# EAGLE schematic base (EAGLE 7.2.0)
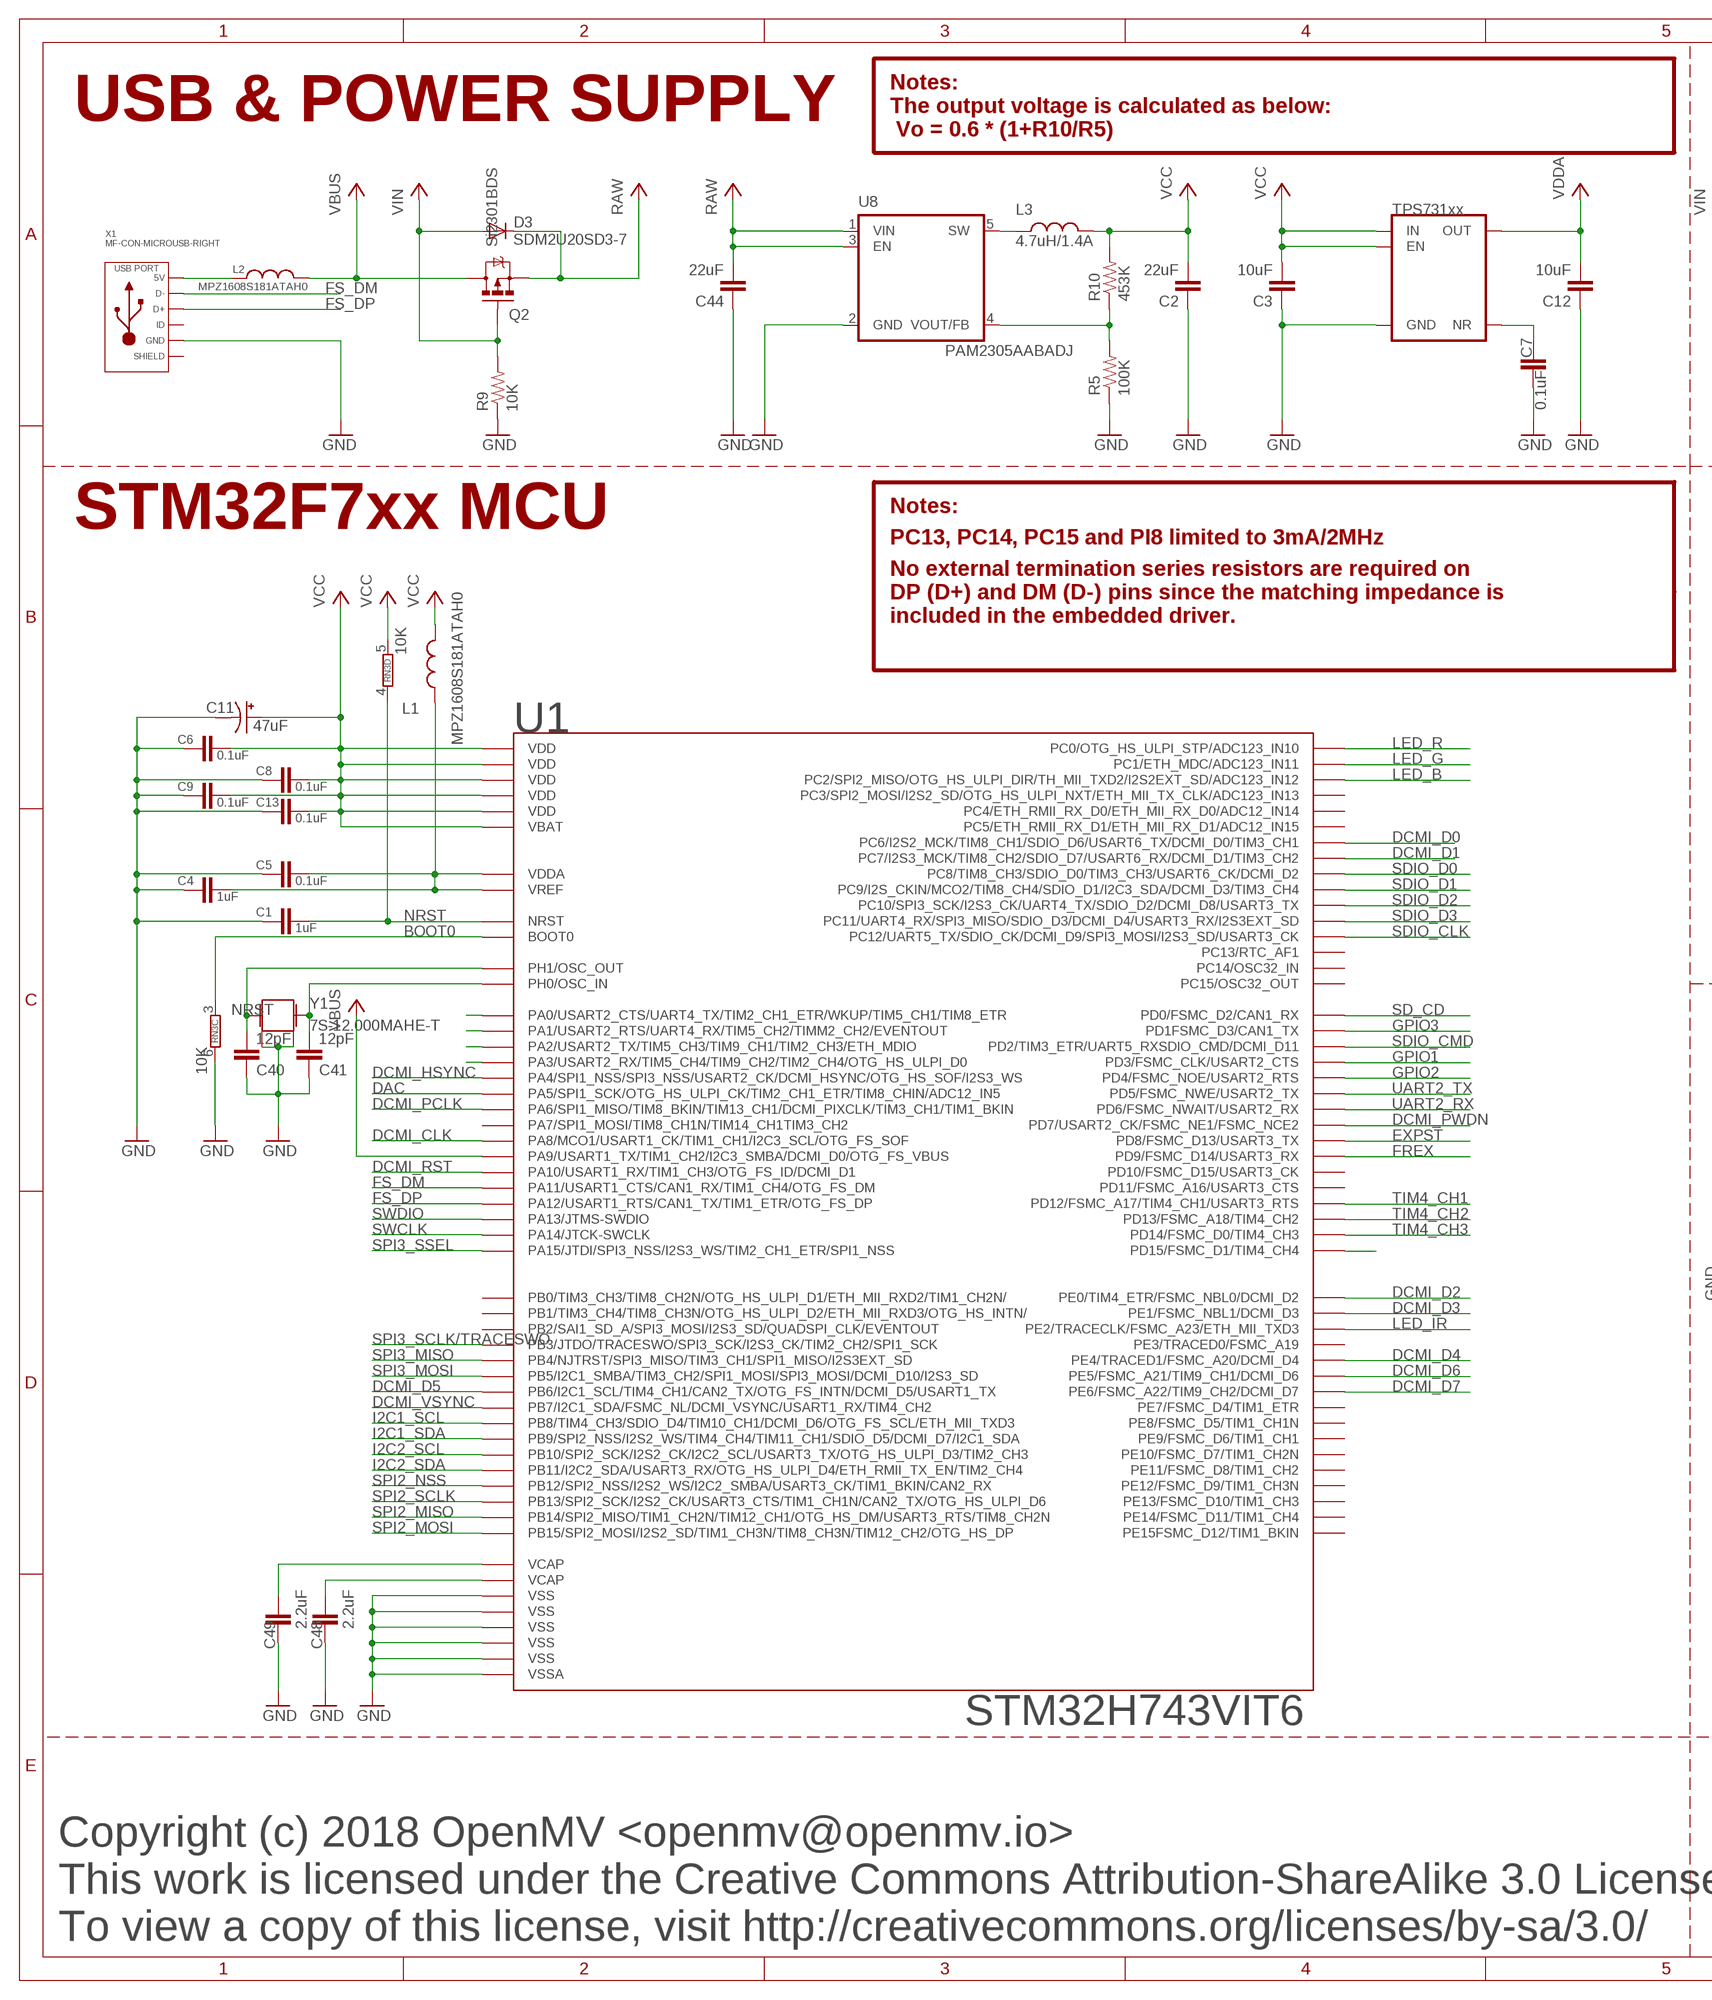
[diagram p0: schematic, sheet 1, part 1 of 2]
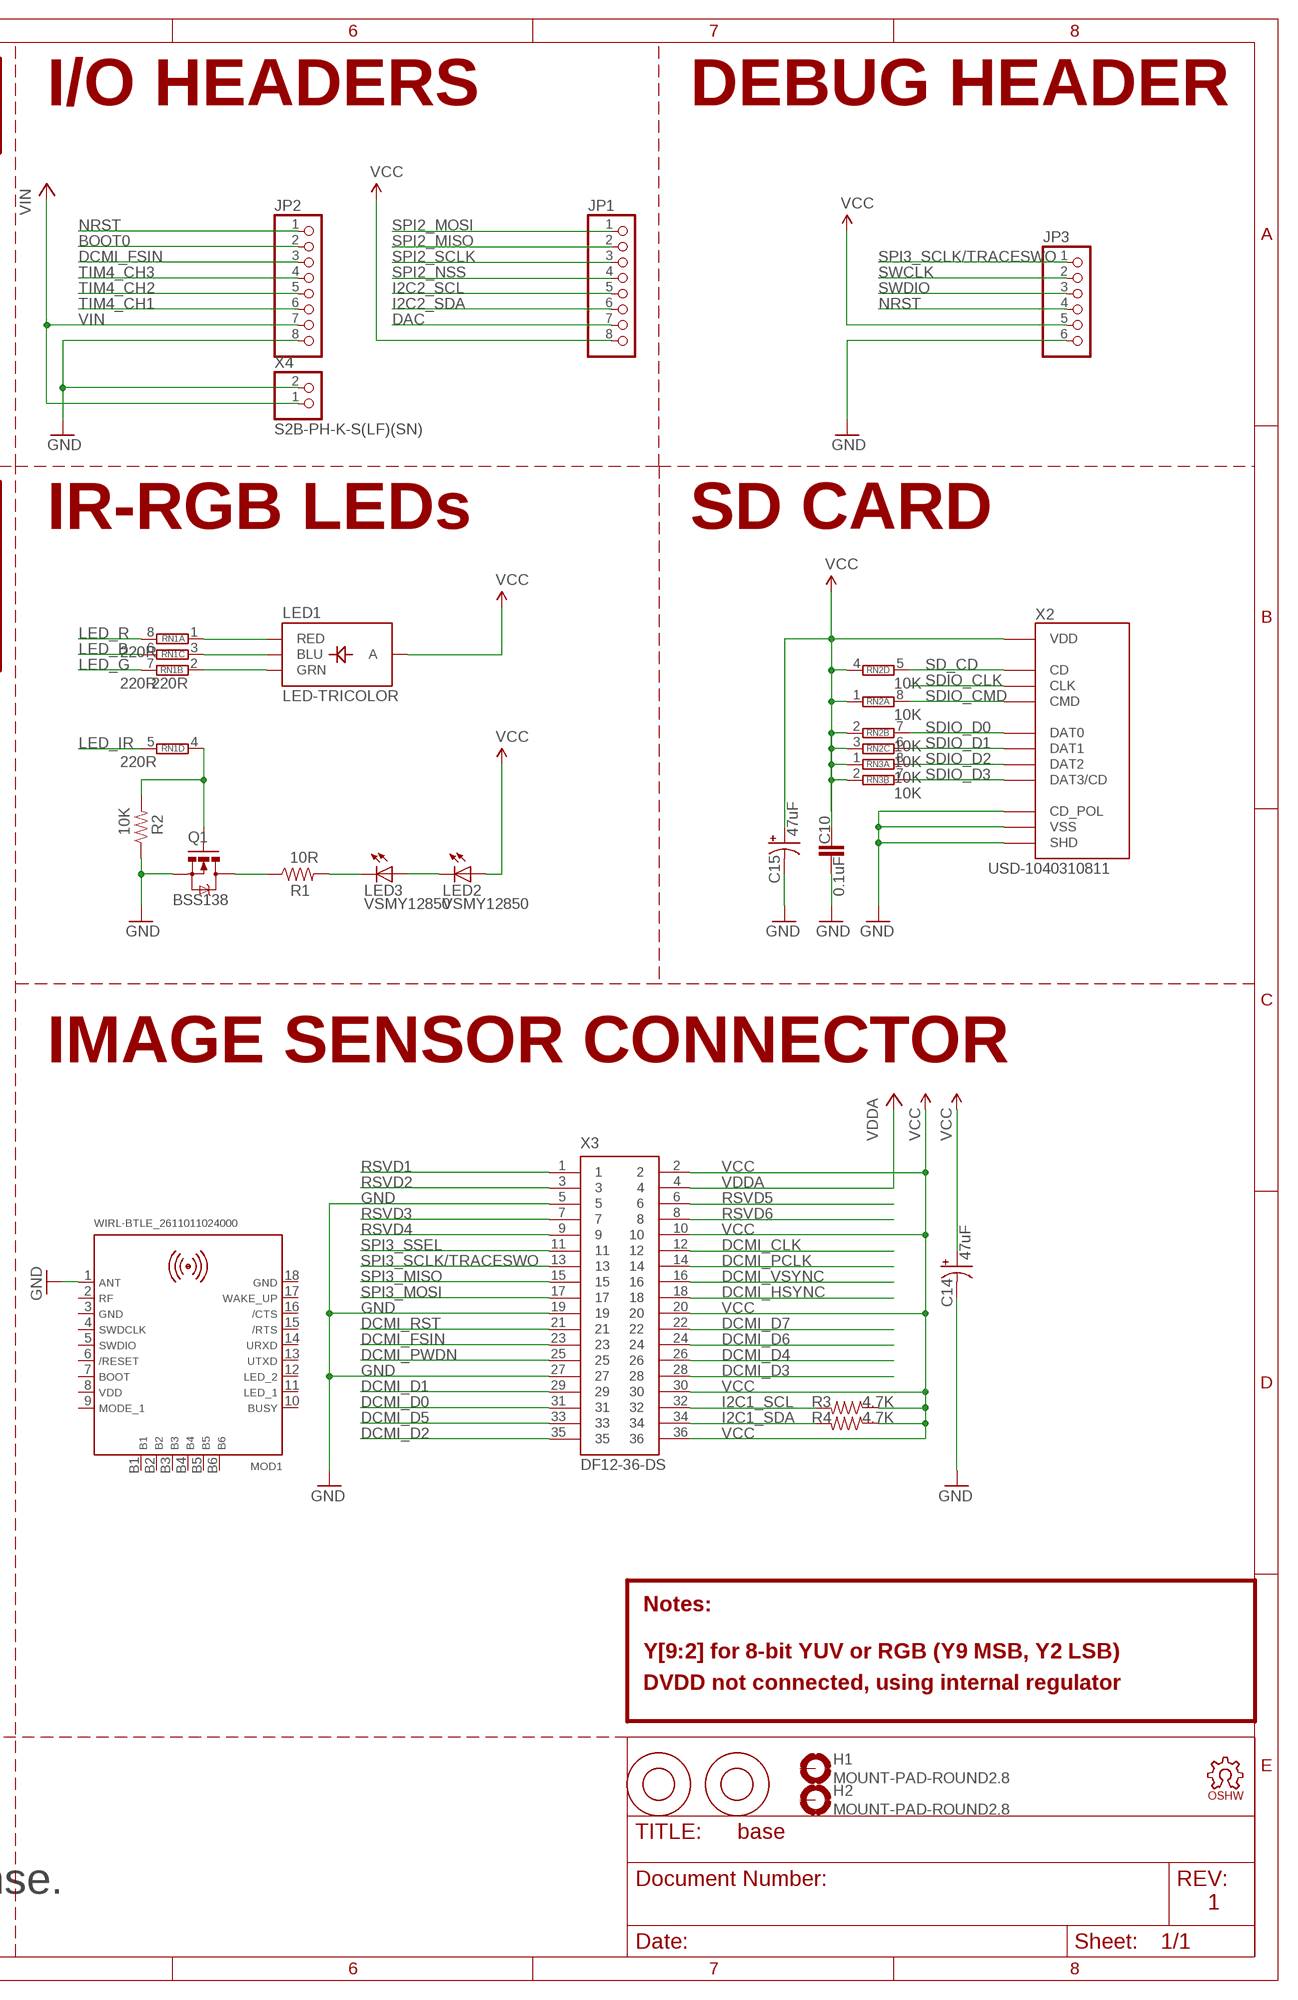
[diagram p1: schematic, sheet 1, part 2 of 2]

## Parts
C1  1uF  CAP0603-CAP  [0603-CAP]
C2  22uF  CAP0805  [0805]
C3  10uF  CAP0805  [0805]
C4  1uF  CAP0603-CAP  [0603-CAP]
C5  0.1uF  CAP0603-CAP  [0603-CAP]
C6  0.1uF  CAP0603-CAP  [0603-CAP]
C7  0.1uF  CAP0603-CAP  [0603-CAP]
C8  0.1uF  CAP0603-CAP  [0603-CAP]
C9  0.1uF  CAP0603-CAP  [0603-CAP]
C10  0.1uF  CAP0603-CAP  [0603-CAP]
C11  47uF  CAP_POL1206  [EIA3216]
C12  10uF  CAP0805  [0805]
C13  0.1uF  CAP0603-CAP  [0603-CAP]
C14  47uF  CAP_POL1206  [EIA3216]
C15  47uF  CAP_POL1206  [EIA3216]
C40  12pF  CAP0603-CAP  [0603-CAP]
C41  12pF  CAP0603-CAP  [0603-CAP]
C44  22uF  CAP0805  [0805]
C48  2.2uF  CAP0603-CAP  [0603-CAP]
C49  2.2uF  CAP0603-CAP  [0603-CAP]
D3  SDM2U20SD3-7  DIODESOD  [SOD-323]
H1  MOUNT-PAD-ROUND2.8  [2,8-PAD]
H2  MOUNT-PAD-ROUND2.8  [2,8-PAD]
JP1  PINHD-1X8  [1X08]
JP2  PINHD-1X8  [1X08]
JP3  PINHD-1X6  [1X06]
L1  MPZ1608S181ATAH0  INDUCTOR0603  [0603]
L2  MPZ1608S181ATAH0  INDUCTOR0603  [0603]
L3  4.7uH/1.4A  INDUCTOR1007  [1007]
LED1  LED-TRICOLOR  [LED-TRICOLOR-SMD-MF]
LED2  VSMY12850  LED1206  [LED-1206]
LED3  VSMY12850  LED1206  [LED-1206]
LOGO1  OSHW_LOGO_FILLX0100-NT  [OSHW_FILLX100_NOTEXT]
M1  9774030243R  9774030151R  [9774030151R]
M2  9774030243R  9774030151R  [9774030151R]
MOD1  WIRL-BTLE_2611011024000  [WE-FP-4+]
Q1  BSS138  MOSFET-NCHANNELSMD  [SOT23-3]
Q2  Si2301BDS  MOSFET-PCHANNELSMD  [SOT23-3]
R1  10R  RESISTOR0603-RES  [0603-RES]
R2  10K  RESISTOR0603-RES  [0603-RES]
R3  4.7K  RESISTOR0603-RES  [0603-RES]
R4  4.7K  RESISTOR0603-RES  [0603-RES]
R5  100K  RESISTOR0603-RES  [0603-RES]
R9  10K  RESISTOR0603-RES  [0603-RES]
R10  453K  RESISTOR0603-RES  [0603-RES]
RN1  220R  4R-NEXBV8V  [EXBV8V]
RN2  10K  4R-NEXBV8V  [EXBV8V]
RN3  10K  4R-NEXBV8V  [EXBV8V]
U1  STM32H743VIT6  STM32F746LQFP100  [LQFP100]
U5  TPS731XX  [SOT23-5]
U8  PAM2305AABADJ  PAM2305AAB330  [TSOT25]
X1  MF-CON-MICROUSB-RIGHT  USB_MICRO_RIGHT  [MICROUSB-RIGHT]
X2  USD-1040310811  [1040310811]
X3  DF12-36-DS  [DF12-36-DS]
X4  S2B-PH-K-S(LF)(SN)  JST_2PIN-THM-RA  [JST-PH-2-THM-RA]
Y1  7S-12.000MAHE-T  CRYSTAL2.5X2.0  [CRYSTAL-2.5X2.0]

## Nets
BOOT0: JP2.2 RN3.3 U1.94(BOOT0)
DAC: JP1.7 U1.29(PA5/SPI1_SCK/OTG_HS_ULPI_CK/TIM2_CH1_ETR/TIM8_CHIN/ADC12_IN5)
DCMI_CLK: U1.67(PA8/MCO1/USART1_CK/TIM1_CH1/I2C3_SCL/OTG_FS_SOF) X3.12
DCMI_D0: U1.63(PC6/I2S2_MCK/TIM8_CH1/SDIO_D6/USART6_TX/DCMI_D0/TIM3_CH1) X3.31
DCMI_D1: U1.64(PC7/I2S3_MCK/TIM8_CH2/SDIO_D7/USART6_RX/DCMI_D1/TIM3_CH2) X3.29
DCMI_D2: U1.97(PE0/TIM4_ETR/FSMC_NBL0/DCMI_D2) X3.35
DCMI_D3: U1.98(PE1/FSMC_NBL1/DCMI_D3) X3.28
DCMI_D4: U1.3(PE4/TRACED1/FSMC_A20/DCMI_D4) X3.26
DCMI_D5: U1.92(PB6/I2C1_SCL/TIM4_CH1/CAN2_TX/OTG_FS_INTN/DCMI_D5/USART1_TX) X3.33
DCMI_D6: U1.4(PE5/FSMC_A21/TIM9_CH1/DCMI_D6) X3.24
DCMI_D7: U1.5(PE6/FSMC_A22/TIM9_CH2/DCMI_D7) X3.22
DCMI_FSIN: JP2.3 X3.23
DCMI_HSYNC: U1.28(PA4/SPI1_NSS/SPI3_NSS/USART2_CK/DCMI_HSYNC/OTG_HS_SOF/I2S3_WS) X3.18
DCMI_PCLK: U1.30(PA6/SPI1_MISO/TIM8_BKIN/TIM13_CH1/DCMI_PIXCLK/TIM3_CH1/TIM1_BKIN) X3.14
DCMI_PWDN: U1.88(PD7/USART2_CK/FSMC_NE1/FSMC_NCE2) X3.25
DCMI_RST: U1.69(PA10/USART1_RX/TIM1_CH3/OTG_FS_ID/DCMI_D1) X3.21
DCMI_VSYNC: U1.93(PB7/I2C1_SDA/FSMC_NL/DCMI_VSYNC/USART1_RX/TIM4_CH2) X3.16
EXPST: U1.55(PD8/FSMC_D13/USART3_TX)
FREX: U1.56(PD9/FSMC_D14/USART3_RX)
FS_DM: U1.70(PA11/USART1_CTS/CAN1_RX/TIM1_CH4/OTG_FS_DM) X1.2(D-)
FS_DP: U1.71(PA12/USART1_RTS/CAN1_TX/TIM1_ETR/OTG_FS_DP) X1.3(D+)
GND: C1.2 C2.1 C3.1 C4.2 C5.2 C6.2 C7.2 C8.2 C9.2 C10.2 C11.C(-) C12.1 C13.2 C14.C(-) C15.C(-) C40.1 C41.1 C44.1 C48.2 C49.2 JP2.8 JP3.6 MOD1.1 Q1.2(S) R2.1 R5.1 R9.1 RN3.6 U1.10(VSS) U1.19(VSSA) U1.26(VSS) U1.49(VSS) U1.74(VSS) U1.99(VSS) U5.2(GND) U8.2(GND) X1.5(GND) X2.CD$2(CD_POL) X2.G$1(SHD) X2.G$2(SHD) X2.G$3(SHD) X2.G$4(SHD) X2.P$6(VSS) X3.5 X3.19 X3.27 X4.2 Y1.2 Y1.4
GPIO1: U1.84(PD3/FSMC_CLK/USART2_CTS)
GPIO2: U1.85(PD4/FSMC_NOE/USART2_RTS)
GPIO3: U1.82(PD1FSMC_D3/CAN1_TX)
I2C1_SCL: R3.2 U1.95(PB8/TIM4_CH3/SDIO_D4/TIM10_CH1/DCMI_D6/OTG_FS_SCL/ETH_MII_TXD3) X3.32
I2C1_SDA: R4.2 U1.96(PB9/SPI2_NSS/I2S2_WS/TIM4_CH4/TIM11_CH1/SDIO_D5/DCMI_D7/I2C1_SDA) X3.34
I2C2_SCL: JP1.5 U1.46(PB10/SPI2_SCK/I2S2_CK/I2C2_SCL/USART3_TX/OTG_HS_ULPI_D3/TIM2_CH3)
I2C2_SDA: JP1.6 U1.47(PB11/I2C2_SDA/USART3_RX/OTG_HS_ULPI_D4/ETH_RMII_TX_EN/TIM2_CH4)
LED_B: RN1.6 U1.17(PC2/SPI2_MISO/OTG_HS_ULPI_DIR/TH_MII_TXD2/I2S2EXT_SD/ADC123_IN12)
LED_G: RN1.7 U1.16(PC1/ETH_MDC/ADC123_IN11)
LED_IR: RN1.5 U1.1(PE2/TRACECLK/FSMC_A23/ETH_MII_TXD3)
LED_R: RN1.8 U1.15(PC0/OTG_HS_ULPI_STP/ADC123_IN10)
N$2: C40.2 U1.13(PH1/OSC_OUT) Y1.3
N$4: C41.2 U1.12(PH0/OSC_IN) Y1.1
N$5: Q1.1(G) R2.2 RN1.4
N$6: LED1.B(BLU) RN1.3
N$7: L2.1 X1.1(5V)
N$8: LED1.R(RED) RN1.1
N$9: LED1.G(GRN) RN1.2
N$10: LED3.C R1.2
N$11: C7.1 U5.4(NR)
N$12: C4.1 C5.1 L1.1 U1.20(VREF) U1.21(VDDA)
N$13: R5.2 R10.1 U8.4(VOUT/FB)
N$14: Q1.3(D) R1.1
N$17: LED2.C LED3.A
N$30: U1.62(PD15/FSMC_D1/TIM4_CH4)
N$31: U1.22(PA0/USART2_CTS/UART4_TX/TIM2_CH1_ETR/WKUP/TIM5_CH1/TIM8_ETR)
N$32: U1.23(PA1/USART2_RTS/UART4_RX/TIM5_CH2/TIMM2_CH2/EVENTOUT)
N$33: U1.24(PA2/USART2_TX/TIM5_CH3/TIM9_CH1/TIM2_CH3/ETH_MDIO)
N$34: U1.25(PA3/USART2_RX/TIM5_CH4/TIM9_CH2/TIM2_CH4/OTG_HS_ULPI_D0)
NRST: C1.1 JP2.1 JP3.4 RN3.4 U1.14(NRST)
RAW: C44.2 D3.1(C) Q2.2(S) U8.1(VIN) U8.3(EN)
RSVD1: X3.1
RSVD2: X3.3
RSVD3: X3.7
RSVD4: X3.9
RSVD5: X3.6
RSVD6: X3.8
SD_CD: RN2.5 U1.81(PD0/FSMC_D2/CAN1_RX) X2.CD$1(CD)
SDIO_CLK: U1.80(PC12/UART5_TX/SDIO_CK/DCMI_D9/SPI3_MOSI/I2S3_SD/USART3_CK) X2.P$5(CLK)
SDIO_CMD: RN2.8 U1.83(PD2/TIM3_ETR/UART5_RXSDIO_CMD/DCMI_D11) X2.P$3(CMD)
SDIO_D0: RN2.7 U1.65(PC8/TIM8_CH3/SDIO_D0/TIM3_CH3/USART6_CK/DCMI_D2) X2.P$7(DAT0)
SDIO_D1: RN2.6 U1.66(PC9/I2S_CKIN/MCO2/TIM8_CH4/SDIO_D1/I2C3_SDA/DCMI_D3/TIM3_CH4) X2.P$8(DAT1)
SDIO_D2: RN3.8 U1.78(PC10/SPI3_SCK/I2S3_CK/UART4_TX/SDIO_D2/DCMI_D8/USART3_TX) X2.P$1(DAT2)
SDIO_D3: RN3.7 U1.79(PC11/UART4_RX/SPI3_MISO/SDIO_D3/DCMI_D4/USART3_RX/I2S3EXT_SD) X2.P$2(DAT3/CD)
SPI2_MISO: JP1.2 U1.53(PB14/SPI2_MISO/TIM1_CH2N/TIM12_CH1/OTG_HS_DM/USART3_RTS/TIM8_CH2N)
SPI2_MOSI: JP1.1 U1.54(PB15/SPI2_MOSI/I2S2_SD/TIM1_CH3N/TIM8_CH3N/TIM12_CH2/OTG_HS_DP)
SPI2_NSS: JP1.4 U1.51(PB12/SPI2_NSS/I2S2_WS/I2C2_SMBA/USART3_CK/TIM1_BKIN/CAN2_RX)
SPI2_SCLK: JP1.3 U1.52(PB13/SPI2_SCK/I2S2_CK/USART3_CTS/TIM1_CH1N/CAN2_TX/OTG_HS_ULPI_D6)
SPI3_MISO: U1.90(PB4/NJTRST/SPI3_MISO/TIM3_CH1/SPI1_MISO/I2S3EXT_SD) X3.15
SPI3_MOSI: U1.91(PB5/I2C1_SMBA/TIM3_CH2/SPI1_MOSI/SPI3_MOSI/DCMI_D10/I2S3_SD) X3.17
SPI3_SCLK/TRACESWO: JP3.1 U1.89(PB3/JTDO/TRACESWO/SPI3_SCK/I2S3_CK/TIM2_CH2/SPI1_SCK) X3.13
SPI3_SSEL: U1.77(PA15/JTDI/SPI3_NSS/I2S3_WS/TIM2_CH1_ETR/SPI1_NSS) X3.11
SW: L3.1 U8.5(SW)
SWCLK: JP3.2 U1.76(PA14/JTCK-SWCLK)
SWDIO: JP3.3 U1.72(PA13/JTMS-SWDIO)
TIM4_CH1: JP2.6 U1.59(PD12/FSMC_A17/TIM4_CH1/USART3_RTS)
TIM4_CH2: JP2.5 U1.60(PD13/FSMC_A18/TIM4_CH2)
TIM4_CH3: JP2.4 U1.61(PD14/FSMC_D0/TIM4_CH3)
UART2_RX: U1.87(PD6/FSMC_NWAIT/USART2_RX)
UART2_TX: U1.86(PD5/FSMC_NWE/USART2_TX)
VBUS: L2.2 Q2.3(D) U1.68(PA9/USART1_TX/TIM1_CH2/I2C3_SMBA/DCMI_D0/OTG_FS_VBUS)
VCAP1: C49.1 U1.48(VCAP)
VCAP2: C48.1 U1.73(VCAP)
VCC: C2.2 C3.2 C6.1 C8.1 C9.1 C10.1 C11.A(+) C13.1 C14.A(+) C15.A(+) JP1.8 JP3.5 L1.2 L3.2 LED1.A LED2.A R3.1 R4.1 R10.2 RN2.1 RN2.2 RN2.3 RN2.4 RN3.1 RN3.2 RN3.5 U1.6(VBAT) U1.11(VDD) U1.27(VDD) U1.50(VDD) U1.75(VDD) U1.100(VDD) U5.1(IN) U5.3(EN) X2.P$4(VDD) X3.2 X3.10 X3.20 X3.30 X3.36
VDDA: C12.2 U5.5(OUT) X3.4
VIN: D3.2(A) JP2.7 Q2.1(G) R9.2 X4.1
Unconnected: H1.B2,8(MOUNT) H2.B2,8(MOUNT) MOD1.2 MOD1.3 MOD1.4 MOD1.5 MOD1.6 MOD1.7 MOD1.8 MOD1.9 MOD1.10 MOD1.11 MOD1.12 MOD1.13 MOD1.14 MOD1.15 MOD1.16 MOD1.17 MOD1.18 MOD1.B1 MOD1.B2 MOD1.B3 MOD1.B4 MOD1.B5 MOD1.B6 U1.2(PE3/TRACED0/FSMC_A19) U1.7(PC13/RTC_AF1) U1.8(PC14/OSC32_IN) U1.9(PC15/OSC32_OUT) U1.18(PC3/SPI2_MOSI/I2S2_SD/OTG_HS_ULPI_NXT/ETH_MII_TX_CLK/ADC123_IN13) U1.31(PA7/SPI1_MOSI/TIM8_CH1N/TIM14_CH1TIM3_CH2) U1.32(PC4/ETH_RMII_RX_D0/ETH_MII_RX_D0/ADC12_IN14) U1.33(PC5/ETH_RMII_RX_D1/ETH_MII_RX_D1/ADC12_IN15) U1.34(PB0/TIM3_CH3/TIM8_CH2N/OTG_HS_ULPI_D1/ETH_MII_RXD2/TIM1_CH2N/) U1.35(PB1/TIM3_CH4/TIM8_CH3N/OTG_HS_ULPI_D2/ETH_MII_RXD3/OTG_HS_INTN/) U1.36(PB2/SAI1_SD_A/SPI3_MOSI/I2S3_SD/QUADSPI_CLK/EVENTOUT) U1.37(PE7/FSMC_D4/TIM1_ETR) U1.38(PE8/FSMC_D5/TIM1_CH1N) U1.39(PE9/FSMC_D6/TIM1_CH1) U1.40(PE10/FSMC_D7/TIM1_CH2N) U1.41(PE11/FSMC_D8/TIM1_CH2) U1.42(PE12/FSMC_D9/TIM1_CH3N) U1.43(PE13/FSMC_D10/TIM1_CH3) U1.44(PE14/FSMC_D11/TIM1_CH4) U1.45(PE15FSMC_D12/TIM1_BKIN) U1.57(PD10/FSMC_D15/USART3_CK) U1.58(PD11/FSMC_A16/USART3_CTS) X1.4(ID) X1.S1(SLD) X1.S2(SLD) X1.S3(SLD) X1.S4(SLD) X1.S5(SLD) X1.S6(SLD)

## Notes on the sheet
- Notes:
- USB & POWER SUPPLY | I/O HEADERS | DEBUG HEADER
- The output voltage is calculated as below:
   Vo = 0.6 * (1+R10/R5)
- Notes:
- STM32F7xx MCU | IR-RGB LEDs | SD CARD
- PC13, PC14, PC15 and PI8 limited to 3mA/2MHz
- No external termination series resistors are required on
  DP (D+) and DM (D-) pins since the matching impedance is
  included in the embedded driver.
- IMAGE SENSOR CONNECTOR
- Notes:
- Y[9:2] for 8-bit YUV or RGB (Y9 MSB, Y2 LSB)
- DVDD not connected, using internal regulator
- Copyright (c) 2018 OpenMV <openmv@openmv.io>
- This work is licensed under the Creative Commons Attribution-ShareAlike 3.0 License.
- 1
- To view a copy of this license, visit http://creativecommons.org/licenses/by-sa/3.0/

## Library data of the parts
C1-C10 C12 C13 C40 C41 C44 C48 C49 = sfe:CAP: Capacitor Standard 0603 ceramic capacitor, and 0.1" leaded capacitor.
C11 C14 C15 = sfe:CAP_POL: Capacitor Polarized These are standard SMD and PTH capacitors. Normally 10uF, 47uF, and 100uF in electrolytic and tantalum varieties. Always verify the external diameter of the through hole cap, it varies with capacity, voltage, and manufacturer. The EIA devices should be standard.
D3 = sfe:DIODE: Diode These are standard reverse protection diodes and small signal diodes. SMA package can handle up to about 1A. SOD-323 can handle about 200mA. What the SOD-323 package when ordering, there are some mfgs out there that are 5-pin packages.
H1 H2 = holes:MOUNT-PAD-ROUND: MOUNTING PAD, round
JP1 JP2 = pinhead:PINHD-1X8: PIN HEADER
JP3 = pinhead:PINHD-1X6: PIN HEADER
L1-L3 = sfe:INDUCTOR: Inductors Basic Inductor/Choke - 0603 and 1206. Footprints are not proven and vary greatly between part numbers.
LED1 = sfe:LED-TRICOLOR: Tri-Color LED SMD Proven layout and schematic for triple color LED in SMD package - common anode. Spark Fun Electronics SKU : COM-07844
LED2 LED3 = sfe:LED: LEDs Standard schematic elements and footprints for 5mm, 3mm, 1206, and 0603 sized LEDs. 5mm - Spark Fun Electronics SKU : COM-00529 (and others)
LOGO1 = iofault:OSHW_LOGO_FILL
M1 M2 = STANDOFFS:9774030151R
MOD1 = WE_WIRL_Rev13.0:WIRL-BTLE_2611011024000: Proteus-III - Bluetooth® LE 5.1 Module WIRL-BTLE Bluetooth® LE 5.1 Module Details see: https://we-online.de/katalog/en/article/2611011024000/; HEIGHT: 2mm; MANUFACTURER: Würth Elektronik; NR: 2611011024000
Q1 = sfe:MOSFET-NCHANNEL
Q2 = sfe:MOSFET-PCHANNEL
R1-R5 R9 R10 = sfe:RESISTOR: Resistor Basic schematic elements and footprints for 0603, 1206, and PTH resistors.
RN1-RN3 = resistor-dil:4R-N: Array Chip Resistor Source: RS Component / Phycomp; OC_FARNELL: unknown; OC_NEWARK: unknown
U1 = stm32:STM32F746
U5 = mux:TPS731XX
U8 = regulators:PAM2305AAB330
X1 = MF_Connectors:USB: Library: MF_Connectors Description: 5 Pin USB Connectors. SLD is the shield connection. Usually tied to ground through a small ferrite bead.
X2 = molex:USD-1040310811
X3 = DF12:DF12-36-DS
X4 = adafruit-updated:JST_2PIN: JST 2-Pin Connectors of various flavors SMT-RA (S2B-PH-SM4) 4UConnector #17311 SMT (B2B-PH-SM4) THM-RA (S2B-PH) THM (B2B-PH)
Y1 = mux:CRYSTAL: Crystals Various standard crystals. Proven footprints. Spark Fun Electronics SKU : COM-00534